# EAGLE design 323ampV1 (EAGLE 7.2.0)
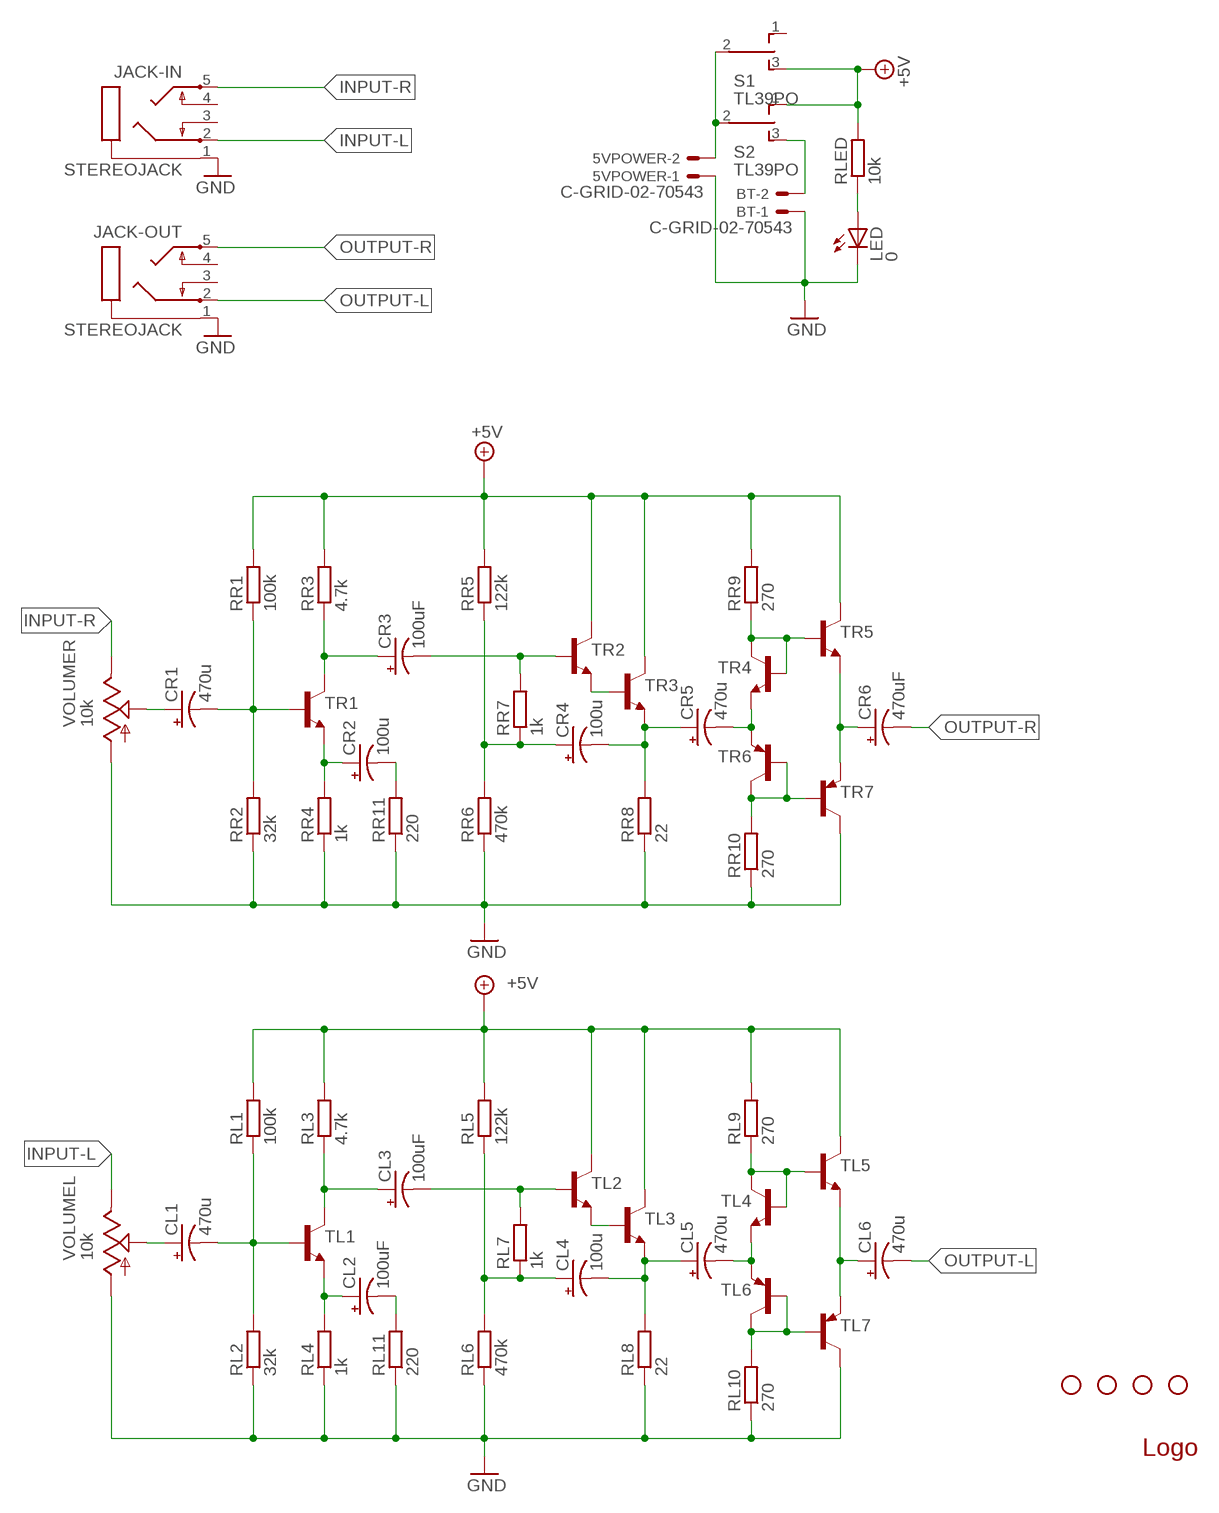
[diagram p0: schematic, sheet 1]

## Parts
5VPOWER  C-GRID-02-70543  [70543-02]
BT  C-GRID-02-70543  [70543-02]
CL1  470u  CPOL-USE2.5-6  [E2,5-6]
CL2  100uF  CPOL-USE2.5-6  [E2,5-6]
CL3  100uF  CPOL-USE2.5-6  [E2,5-6]
CL4  100u  CPOL-USE2.5-6  [E2,5-6]
CL5  470u  CPOL-USE2.5-6  [E2,5-6]
CL6  470u  CPOL-USE2.5-6  [E2,5-6]
CR1  470u  CPOL-USE2.5-6  [E2,5-6]
CR2  100u  CPOL-USE2.5-6  [E2,5-6]
CR3  100uF  CPOL-USE2.5-6  [E2,5-6]
CR4  100u  CPOL-USE2.5-6  [E2,5-6]
CR5  470u  CPOL-USE2.5-6  [E2,5-6]
CR6  470uF  CPOL-USE2.5-6  [E2,5-6]
JACK-IN  STEREOJACK  [STX3100]
JACK-OUT  STEREOJACK  [STX3100]
JP2  STAND-OFF  [STAND-OFF]
JP3  STAND-OFF  [STAND-OFF]
JP4  STAND-OFF  [STAND-OFF]
JP5  STAND-OFF  [STAND-OFF]
LED  0  LED-3MM-MINUS  [LED3MM-MINUS]
RL1  100k  R-EU_0204/7  [0204/7]
RL2  32k  R-EU_0204/7  [0204/7]
RL3  4.7k  R-EU_0204/7  [0204/7]
RL4  1k  R-EU_0204/7  [0204/7]
RL5  122k  R-EU_0204/7  [0204/7]
RL6  470k  R-EU_0204/7  [0204/7]
RL7  1k  R-EU_0204/7  [0204/7]
RL8  22  R-EU_0204/7  [0204/7]
RL9  270  R-EU_0204/7  [0204/7]
RL10  270  R-EU_0204/7  [0204/7]
RL11  220  R-EU_0204/7  [0204/7]
RLED  10k  R-EU_0204/7  [0204/7]
RR1  100k  R-EU_0204/7  [0204/7]
RR2  32k  R-EU_0204/7  [0204/7]
RR3  4.7k  R-EU_0204/7  [0204/7]
RR4  1k  R-EU_0204/7  [0204/7]
RR5  122k  R-EU_0204/7  [0204/7]
RR6  470k  R-EU_0204/7  [0204/7]
RR7  1k  R-EU_0204/7  [0204/7]
RR8  22  R-EU_0204/7  [0204/7]
RR9  270  R-EU_0204/7  [0204/7]
RR10  270  R-EU_0204/7  [0204/7]
RR11  220  R-EU_0204/7  [0204/7]
S1  TL39PO  [TL3XPO]
S2  TL39PO  [TL3XPO]
TL1  2N4401-NPN-TO92-EBC  [TO92-EBC]
TL2  2N4401-NPN-TO92-EBC  [TO92-EBC]
TL3  2N4401-NPN-TO92-EBC  [TO92-EBC]
TL4  2N4401-NPN-TO92-EBC  [TO92-EBC]
TL5  2N4401-NPN-TO92-EBC  [TO92-EBC]
TL6  2N4403-PNP-TO92-EBC  [TO92-EBC]
TL7  2N4403-PNP-TO92-EBC  [TO92-EBC]
TR1  2N4401-NPN-TO92-EBC  [TO92-EBC]
TR2  2N4401-NPN-TO92-EBC  [TO92-EBC]
TR3  2N4401-NPN-TO92-EBC  [TO92-EBC]
TR4  2N4401-NPN-TO92-EBC  [TO92-EBC]
TR5  2N4401-NPN-TO92-EBC  [TO92-EBC]
TR6  2N4403-PNP-TO92-EBC  [TO92-EBC]
TR7  2N4403-PNP-TO92-EBC  [TO92-EBC]
U$1  OSHW-LOGO-OUTLINE  [OSHW-LOGO-OUTLINE]
VOLUME  10k  ALPS_RK0971221Z0N  [ALPS_RK0971221Z0X]

## Nets
+5V: RL1.2 RL3.2 RL5.2 RL9.2 RLED.2 RR1.2 RR3.2 RR5.2 RR9.2 S1.3(S) S2.1(O) TL2.C TL3.C TL5.C TR2.C TR3.C TR5.C
GND: 5VPOWER.1 BT.1 JACK-IN.1 JACK-OUT.1 LED.K(C) RL2.1 RL4.1 RL6.1 RL8.1 RL10.1 RL11.1 RR2.1 RR4.1 RR6.1 RR8.1 RR10.1 RR11.1 TL7.C TR7.C VOLUME.G1 VOLUME.G2
INPUT-L: JACK-IN.2 VOLUME.I1
INPUT-R: JACK-IN.5 VOLUME.I2
N$1: LED.A RLED.1
N$2: 5VPOWER.2 S1.2(P) S2.2(P)
N$3: TR2.E TR3.B
N$4: CR3.+ RR3.1 TR1.C
N$5: RL9.1 TL4.B TL4.C TL5.B
N$6: CL5.- TL4.E TL6.E
N$7: RL10.2 TL6.B TL6.C TL7.B
N$8: CL6.+ TL5.E TL7.E
N$9: CL4.- CL5.+ RL8.2 TL3.E
N$10: CL4.+ RL5.1 RL6.2 RL7.1
N$11: CL3.- RL7.2 TL2.B
N$12: CL2.- RL11.2
N$13: CL2.+ RL4.2 TL1.E
N$14: CL1.+ VOLUME.O1
N$15: TL2.E TL3.B
N$16: CL3.+ RL3.1 TL1.C
N$17: BT.2 S2.3(S)
N$22: RR9.1 TR4.B TR4.C TR5.B
N$23: CR5.- TR4.E TR6.E
N$24: RR10.2 TR6.B TR6.C TR7.B
N$25: CR6.+ TR5.E TR7.E
N$26: CR4.- CR5.+ RR8.2 TR3.E
N$27: CR4.+ RR5.1 RR6.2 RR7.1
N$28: CR3.- RR7.2 TR2.B
N$30: CR2.- RR11.2
N$31: CR2.+ RR4.2 TR1.E
N$32: CR1.+ VOLUME.O2
OUTPUT-L: CL6.- JACK-OUT.2
OUTPUT-R: CR6.- JACK-OUT.5
R+: CR1.- RR1.1 RR2.2 TR1.B
R+1: CL1.- RL1.1 RL2.2 TL1.B
Unconnected: JACK-IN.3 JACK-IN.4 JACK-OUT.3 JACK-OUT.4 S1.1(O)

## Power pins joined to a net without a drawn wire
S1: VOLUME.S1
S2: VOLUME.S2

## Library data of the parts
5VPOWER BT = con-molex:C-GRID-02: CONNECTOR wire to board 2.54 mm (0.100") pitch header; OC_FARNELL: unknown; OC_NEWARK: unknown
CL1-CL6 CR1-CR6 = rcl:CPOL-US: POLARIZED CAPACITOR, American symbol
JACK-IN JACK-OUT = akafugu:STEREOJACK: MIC/HEADPHONE JACK Stereo jack with two switches. Kycon STX3100, CUI SJ1-3555NG and/or 4UCon 05544
JP2-JP5 = SparkFun:STAND-OFF: Stand Off This is the mechanical footprint for a #4 phillips button head screw. Use the keepout ring to avoid running the screw head into surrounding components. SKU : PRT-00447
LED = akafugu:LED: LEDs Standard schematic elements and footprints for 5mm, 3mm, 1206, and 0603 sized LEDs. 5mm - Spark Fun Electronics SKU : COM-00529 (and others)
RL1-RL11 RLED RR1-RR11 = rcl:R-EU_: RESISTOR, European symbol
S1 S2 = switch:TL39PO: TINY SWITCH ON OFF ON Source: http://www2.produktinfo.conrad.com/datenblaetter/700000-724999/705152-da-01-de-Subminiaturschalter_TL_36YO.pdf
TL1-TL5 TR1-TR5 = transistor-neu-to92:*-NPN-: NPN Transistror
TL6 TL7 TR6 TR7 = transistor-neu-to92:*-PNP-: PNP Transistror
U$1 = akafugu:OSHW-LOGO
VOLUME = audio-pots:ALPS_RK0971221Z0*: ALPS RK0971221Z Dual-gang 9mm potentiometer for volume control, with SPST switch -05 model: 10K with "volume" taper -0N model: 50K with traditional audio taper

## Net classes
0 default: width 0.254 mm, drill 0.305 mm, clearance 0.152 mm

## Board
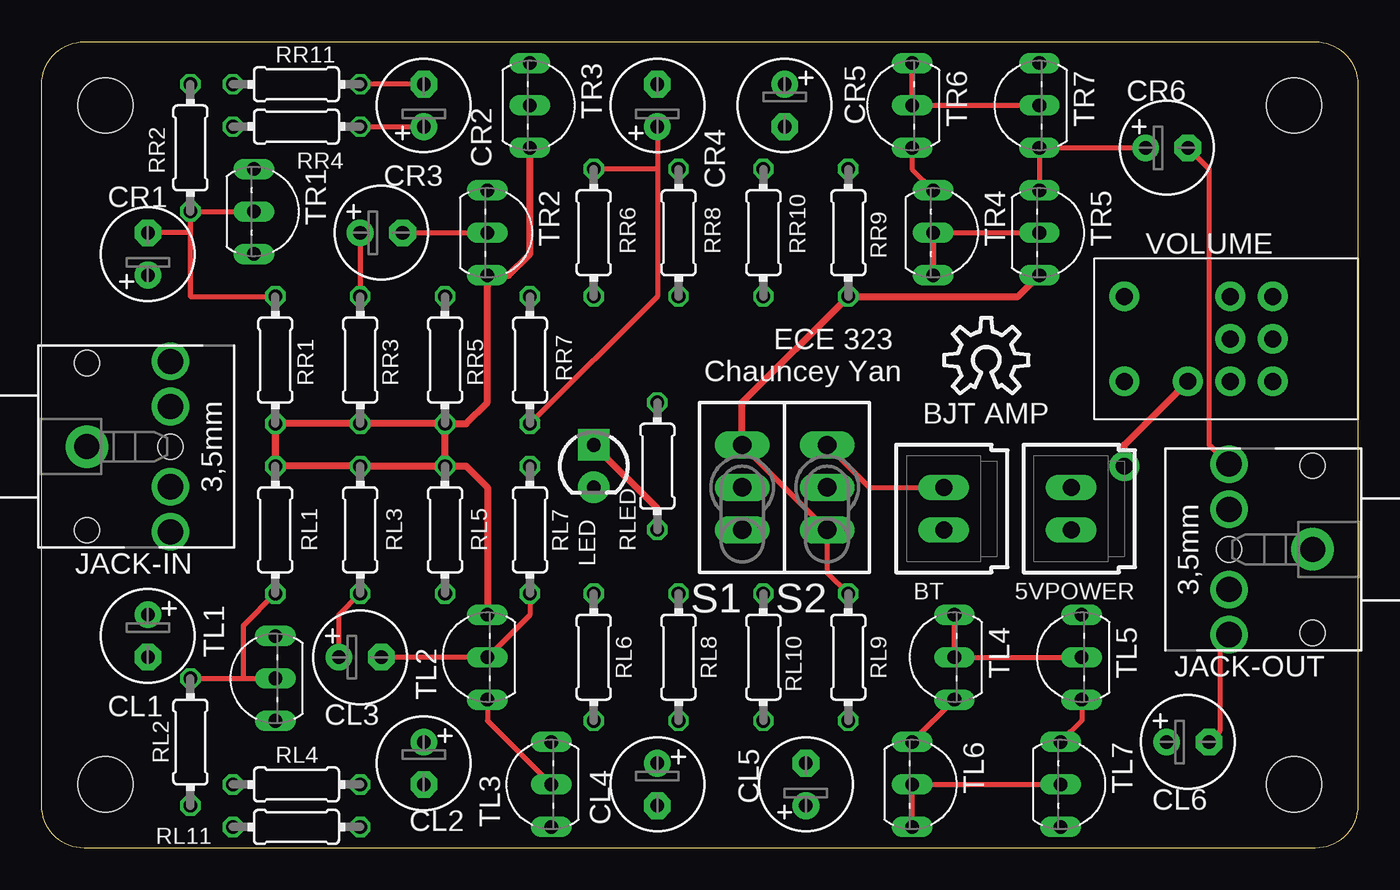
[diagram p1: board, top side]
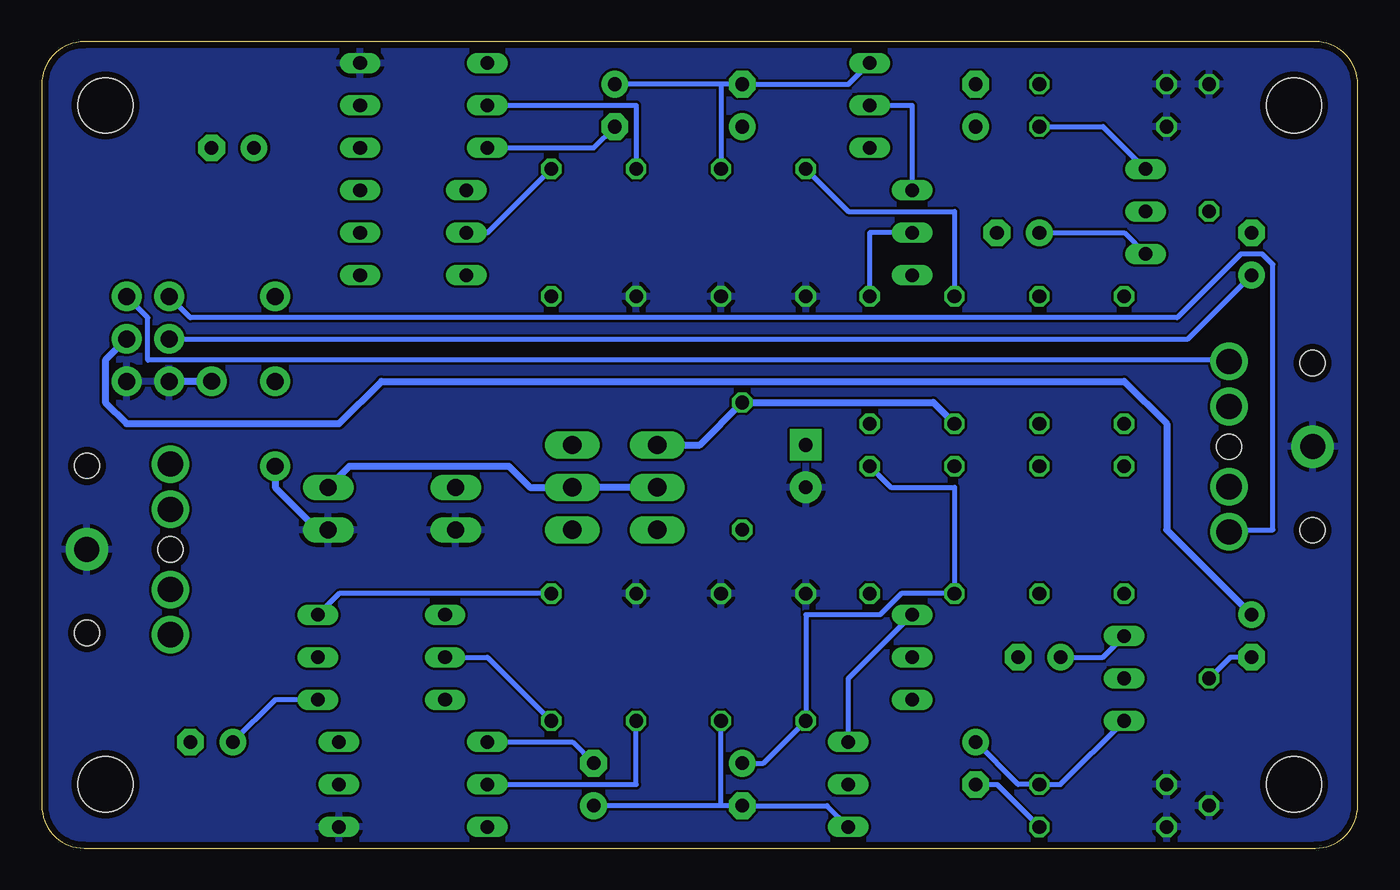
[diagram p2: board, bottom side, seen from below]

Size 78.74 x 48.26 mm. Coordinates in mm from the lower left corner, seen from the top.
Outline: 0,45.72 arc-90 2.54,48.26 76.2,48.26 arc-90 78.74,45.72 78.74,2.54 arc-90 76.2,0 2.54,0 arc-90 0,2.54 0,45.72
Copper layers (1*16): Top 0.0356mm / dielectric 1.5011mm / Bottom 0.0356mm
Design rules "LaenPCBOrder *": minimum track width 12mil, minimum drill 13mil, track to track 6mil, track to pad 6mil, pad to pad 6mil, via to via 6mil, smd to smd 6mil, copper to edge 15mil, drill to drill 6mil, minimum pad ring 7mil, minimum via ring 7mil, stop-mask expansion 3mil, vias tented up to drill 0mil, thermal gap 10mil

### Footprints (pad centres in the part's own frame; a part is rotated, then mirrored left to right if it is on the bottom)
70543-02 = drill 1.016 long: 1 -1.27,0; 2 1.27,0
E2,5-6 = drill 0.813 pad 1.6: + -1.27,0 | drill 0.813 pad 1.6 octagon: - 1.27,0
STX3100 = drill 1.5 pad 2.54: 1 2.7,-0.1 | drill 1.5: 2 7.7,5; 3 7.7,2.3; 4 7.7,-2.5; 5 7.7,-5.2 | hole 1.5: 2.7,4.9; 2.7,-5.1; 7.7,-0.1
STAND-OFF = hole 3.302: 0,0
LED3MM-MINUS = drill 0.813 pad 1.88 square: A -1.27,0 | drill 0.813 pad 1.88: K 1.27,0
0204/7 = drill 0.813 octagon: 1 -3.81,0; 2 3.81,0
TL3XPO = drill 1.1 pad 1.422 long: 1 -2.54,0; 2 0,0; 3 2.54,0
TO92-EBC = drill 0.813 long: B 0,-1.27; C 2.54,-1.27; E -2.54,-1.27
ALPS_RK0971221Z0X = drill 1.016 pad 1.778: G1 2.54,-2.54; G2 0,-2.54; I1 2.54,2.54; I2 0,2.54; O1 2.54,0; O2 0,0; S1 -6.35,-2.54; S2 -6.35,2.54

### Placement (x,y rotation side)
5VPOWER  61.59,20.32 90 top
BT  53.97,20.32 90 top
CL1  6.35,12.7 270 top
CL2  22.86,5.08 270 top
CL3  19.05,11.43 0 top
CL4  36.83,3.81 270 top
CL5  45.72,3.81 90 top
CL6  68.58,6.35 0 top
CR1  6.35,35.56 90 top
CR2  22.86,44.45 90 top
CR3  20.32,36.83 0 top
CR4  36.83,44.45 90 top
CR5  44.45,44.45 270 top
CR6  67.31,41.91 0 top
JACK-IN  0,24.13 0 top
JACK-OUT  78.74,17.78 180 top
JP2  3.81,3.81 0 top
JP3  3.81,44.45 0 top
JP4  74.93,3.81 0 top
JP5  74.93,44.45 0 top
LED  33.02,22.86 270 top
RL1  13.97,19.05 90 top
RL2  8.89,6.35 90 top
RL3  19.05,19.05 90 top
RL4  15.24,3.81 0 top
RL5  24.13,19.05 90 top
RL6  33.02,11.43 270 top
RL7  29.21,19.05 270 top
RL8  38.1,11.43 270 top
RL9  48.26,11.43 90 top
RL10  43.18,11.43 270 top
RL11  15.24,1.27 0 top
RLED  36.83,22.86 90 top
RR1  13.97,29.21 270 top
RR2  8.89,41.91 270 top
RR3  19.05,29.21 270 top
RR4  15.24,43.18 0 top
RR5  24.13,29.21 270 top
RR6  33.02,36.83 90 top
RR7  29.21,29.21 90 top
RR8  38.1,36.83 90 top
RR9  48.26,36.83 270 top
RR10  43.18,36.83 90 top
RR11  15.24,45.72 0 top
S1  41.91,21.59 90 top
S2  46.99,21.59 90 top
TL1  12.7,10.16 90 top
TL2  25.4,11.43 90 top
TL3  29.21,3.81 90 top
TL4  53.34,11.43 90 top
TL5  60.96,11.43 90 top
TL6  53.34,3.81 270 top
TL7  62.23,3.81 270 top
TR1  13.97,38.1 270 top
TR2  27.94,36.83 270 top
TR3  30.48,44.45 270 top
TR4  54.61,36.83 270 top
TR5  60.96,36.83 270 top
TR6  50.8,44.45 90 top
TR7  58.42,44.45 90 top
U$1  56.51,29.21 0 top
VOLUME  71.12,30.48 0 top

### Tracks (layer width: path | path; a pad name or v marks a point on that pad's centre or on a via)
+5V
  Top 0.305: RL9.2 46.99,16.51 S2.1 S1.3
  Top 0.406: RR5.2 RR3.2 RR1.2 RL1.2 RL3.2 RL5.2 | RL5.2 25.4,22.86 26.67,21.59 TL2.C | RL5.2 RR5.2 | RR5.2 25.4,25.4 26.67,26.67 TR2.C 27.94,34.29 29.21,35.56 TR3.C | S1.3 41.91,26.67 RR9.2 58.42,33.02 TR5.C
  Bottom 0.305: TL5.C 60.96,15.24 RL9.2 | TL2.C 30.48,10.16 TL3.C
  Bottom 0.406: S1.3 39.37,24.13 RLED.2 25.4,26.67 RR5.2
GND
  pour Bottom: -2.54,50.8 -2.54,-2.54 81.28,-2.54 81.28,50.8
INPUT-L
  Bottom 0.305: VOLUME.I1 72.39,31.75 72.39,29.21 8.26,29.21 JACK-IN.2
INPUT-R
  Bottom 0.305: VOLUME.I2 69.85,31.75 10.79,31.75 6.99,35.56 5.71,35.56 5.08,34.92 5.08,19.05 7.62,19.05 JACK-IN.5
N$1
  Top 0.406: RLED.1 36.83,20.32 LED.A
N$2
  Bottom 0.406: 5VPOWER.2 60.32,22.86 50.8,22.86 49.53,21.59 S2.2 S1.2
N$3
  Bottom 0.305: TR2.E 26.67,44.45 TR3.B
N$4
  Top 0.305: CR3.+ RR3.1
  Bottom 0.305: TR1.C 13.97,36.83 CR3.+
N$5
  Top 0.305: TL4.C TL4.B TL5.B
  Bottom 0.305: RL9.1 52.07,11.43 TL4.B
N$6
  Top 0.305: TL4.E TL6.E
  Bottom 0.305: CL5.- 46.99,6.35 TL6.E
N$7
  Top 0.305: TL6.C TL6.B TL7.B
  Bottom 0.305: RL10.2 43.18,3.81 TL6.B
N$8
  Top 0.305: TL7.E 62.23,7.62 TL5.E
  Bottom 0.305: CL6.+ 64.77,8.89 TL5.E
N$9
  Bottom 0.305: TL3.E 31.75,2.54 CL4.- 38.1,2.54 | 38.1,2.54 RL8.2 | 38.1,2.54 CL5.+
N$10
  Bottom 0.305: CL4.+ 35.56,5.08 RL6.2 33.02,13.97 28.57,13.97 27.3,15.24 RL5.1 24.13,21.59 27.94,21.59 RL7.1
N$11
  Top 0.305: RL7.2 29.21,13.97 TL2.B CL3.-
N$12
  Bottom 0.305: RL11.2 21.59,3.81 CL2.-
N$13
  Bottom 0.305: TL1.E 17.78,3.81 RL4.2 20.32,3.81 CL2.+
N$14
  Bottom 0.406: VOLUME.O1 74.93,29.21 74.93,26.67 73.66,25.4 60.96,25.4 58.42,27.94 13.97,27.94 11.43,25.4 11.43,19.05 CL1.+
N$15
  Top 0.305: TL3.B 26.67,7.62 TL2.E
N$16
  Top 0.305: RL3.1 17.78,13.97 CL3.+
  Bottom 0.305: TL1.C 15.24,11.43 CL3.+
N$17
  Top 0.305: BT.2 49.53,21.59 S2.3
N$18  (via drill 1 pad 1.78)
  Top 0.406: v64.77,22.86 64.77,24.13 v68.58,27.94
  Bottom 0.406: v64.77,22.86 64.77,21.59 62.23,19.05 | v68.58,27.94 70.48,27.94
N$22
  Top 0.305: TR4.C TR4.B TR5.B
  Bottom 0.305: RR9.1 52.07,36.83 TR4.B
N$23
  Top 0.305: TR4.E 52.07,40.64 TR6.E
  Bottom 0.305: CR5.- 45.72,41.91 TR6.E
N$24
  Top 0.305: TR7.B TR6.B TR6.C
  Bottom 0.305: RR10.2 43.18,44.45 TR6.B
N$25
  Top 0.305: TR5.E TR7.E CR6.+
N$26
  Bottom 0.305: 38.1,45.72 RR8.2 | 38.1,45.72 CR4.- 30.48,45.72 TR3.E | 38.1,45.72 CR5.+
N$27
  Top 0.305: RR7.1 36.83,33.02 36.83,40.64 | CR4.+ 36.83,40.64 | 36.83,40.64 RR6.2
  Bottom 0.305: RR5.1 24.13,38.1 30.48,38.1 RR6.2
N$28
  Top 0.305: CR3.- TR2.B
  Bottom 0.305: RR7.2 29.21,36.83 TR2.B
N$30
  Top 0.305: CR2.- RR11.2
N$31
  Top 0.305: RR4.2 CR2.+
  Bottom 0.305: TR1.E 15.24,43.18 RR4.2
N$32
  Bottom 0.305: CR1.+ 10.16,30.48 VOLUME.O2
OUTPUT-L
  Top 0.305: CL6.- 70.48,6.99 70.48,12.7 JACK-OUT.2
OUTPUT-R
  Top 0.305: CR6.- 69.85,40.64 69.85,24.13 70.48,23.5 JACK-OUT.5
R+
  Top 0.305: RR1.1 8.89,33.02 8.89,36.83 | 8.89,36.83 RR2.2 TR1.B | 8.89,36.83 CR1.-
R+1
  Top 0.305: RL2.2 12.07,10.16 | 12.07,10.16 TL1.B | RL1.1 12.07,13.34 12.07,10.16
  Bottom 0.305: RL2.2 7.62,11.43 CL1.-

### Text on the board
tNames: ECE 323 / Chauncey Yan | BJT AMP